# EAGLE design nRF52832_MCU (EAGLE 8.0.1)

## Sheet 1 of 2
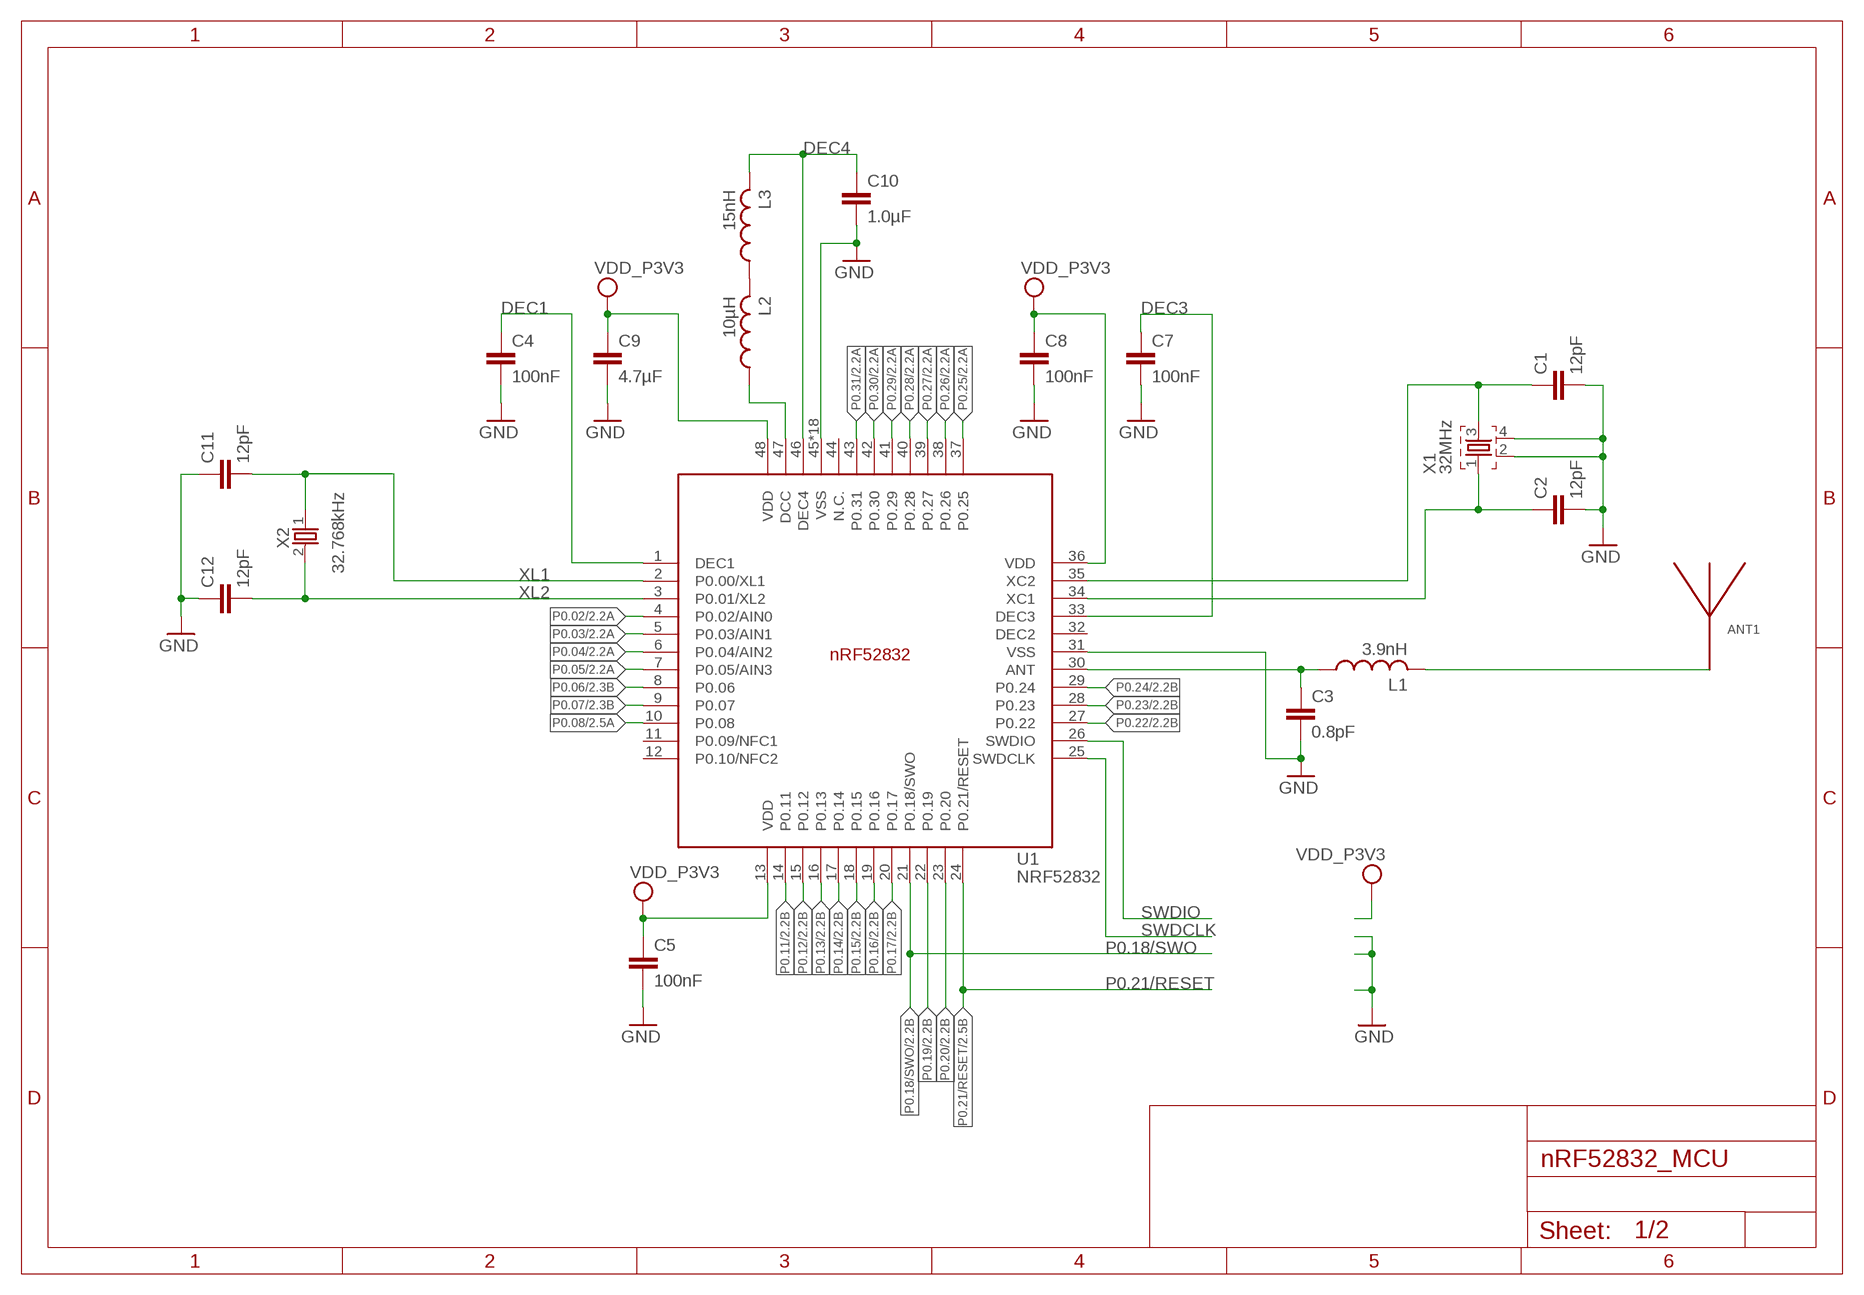
[diagram p0: schematic, sheet 1]

### Parts
ANT1  ANTENNA_QUARTER-WAVE_MONOPOLE_MEANDERED_LEFT  [QWMP_MEANDERED_LEFT_+6]
C1  12pF  CAPACITOR_0402_N  [RESC0402_N]
C2  12pF  CAPACITOR_0402_N  [RESC0402_N]
C3  0.8pF  CAPACITOR_0402_N  [RESC0402_N]
C4  100nF  CAPACITOR_0402_N  [RESC0402_N]
C5  100nF  CAPACITOR_0402_N  [RESC0402_N]
C7  100nF  CAPACITOR_0402_N  [RESC0402_N]
C8  100nF  CAPACITOR_0402_N  [RESC0402_N]
C9  4.7µF  CAPACITOR_0603_N  [RESC0603_N]
C10  1.0µF  CAPACITOR_0603_N  [RESC0603_N]
C11  12pF  CAPACITOR_0402_N  [RESC0402_N]
C12  12pF  CAPACITOR_0402_N  [RESC0402_N]
L1  3.9nH  INDUCTOR_0402_N  [RESC0402_N]
L2  10µH  INDUCTOR_0603_N  [RESC0603_N]
L3  15nH  INDUCTOR_0402_N  [RESC0402_N]
U1  NRF52832  [QFN40P600X600X90-48_N]
X1  32MHz  XTAL_32MHZ  [BT-XTAL_2016_N]
X2  32.768kHz  XTAL_32KHZ  [XTAL_3215_N]

### Nets
ANT: C3.1 L1.1 U1.30(ANT)
DEC1: C4.1 U1.1(DEC1)
DEC3: C7.1 U1.33(DEC3)
DEC4: C10.1 L3.2 U1.46(DEC4)
GND: C1.2 C2.2 C3.2 C4.2 C5.2 C7.2 C8.2 C9.2 C10.2 C11.1 C12.1 U1.31(VSS) U1.45(VSS) U1.PAD(VSS) U1.PAD@VIA01(VSS) U1.PAD@VIA02(VSS) U1.PAD@VIA03(VSS) U1.PAD@VIA04(VSS) U1.PAD@VIA05(VSS) U1.PAD@VIA06(VSS) U1.PAD@VIA07(VSS) U1.PAD@VIA08(VSS) U1.PAD@VIA09(VSS) U1.PAD@VIA10(VSS) U1.PAD@VIA11(VSS) U1.PAD@VIA12(VSS) U1.PAD@VIA13(VSS) U1.PAD@VIA14(VSS) U1.PAD@VIA15(VSS) U1.PAD@VIA16(VSS) X1.2 X1.4 ; also sheet 2
N$2: L2.2 L3.1
N$3: C1.1 U1.35(XC2) X1.3
N$4: L2.1 U1.47(DCC)
N$5: ANT1.P$1 L1.2
P0.02: U1.4(P0.02/AIN0) ; also sheet 2
P0.03: U1.5(P0.03/AIN1) ; also sheet 2
P0.04: U1.6(P0.04/AIN2) ; also sheet 2
P0.05: U1.7(P0.05/AIN3) ; also sheet 2
P0.06: U1.8(P0.06) ; also sheet 2
P0.07: U1.9(P0.07) ; also sheet 2
P0.08: U1.10(P0.08) ; also sheet 2
P0.11: U1.14(P0.11) ; also sheet 2
P0.12: U1.15(P0.12) ; also sheet 2
P0.13: U1.16(P0.13) ; also sheet 2
P0.14: U1.17(P0.14) ; also sheet 2
P0.15: U1.18(P0.15) ; also sheet 2
P0.16: U1.19(P0.16) ; also sheet 2
P0.17: U1.20(P0.17) ; also sheet 2
P0.18/SWO: U1.21(P0.18/SWO) ; also sheet 2
P0.19: U1.22(P0.19) ; also sheet 2
P0.20: U1.23(P0.20) ; also sheet 2
P0.21/RESET: U1.24(P0.21/RESET) ; also sheet 2
P0.22: U1.27(P0.22) ; also sheet 2
P0.23: U1.28(P0.23) ; also sheet 2
P0.24: U1.29(P0.24) ; also sheet 2
P0.25: U1.37(P0.25) ; also sheet 2
P0.26: U1.38(P0.26) ; also sheet 2
P0.27: U1.39(P0.27) ; also sheet 2
P0.28: U1.40(P0.28) ; also sheet 2
P0.29: U1.41(P0.29) ; also sheet 2
P0.30: U1.42(P0.30) ; also sheet 2
P0.31: U1.43(P0.31) ; also sheet 2
SWDCLK: U1.25(SWDCLK)
SWDIO: U1.26(SWDIO)
VDD_P3V3: C5.1 C8.1 C9.1 U1.13(VDD) U1.36(VDD) U1.48(VDD) ; also sheet 2
X1: C2.1 U1.34(XC1) X1.1
XL1: C11.2 U1.2(P0.00/XL1) X2.1
XL2: C12.2 U1.3(P0.01/XL2) X2.2
Unconnected: U1.11(P0.09/NFC1) U1.12(P0.10/NFC2) U1.32(DEC2) U1.44(N.C.)

## Sheet 2 of 2
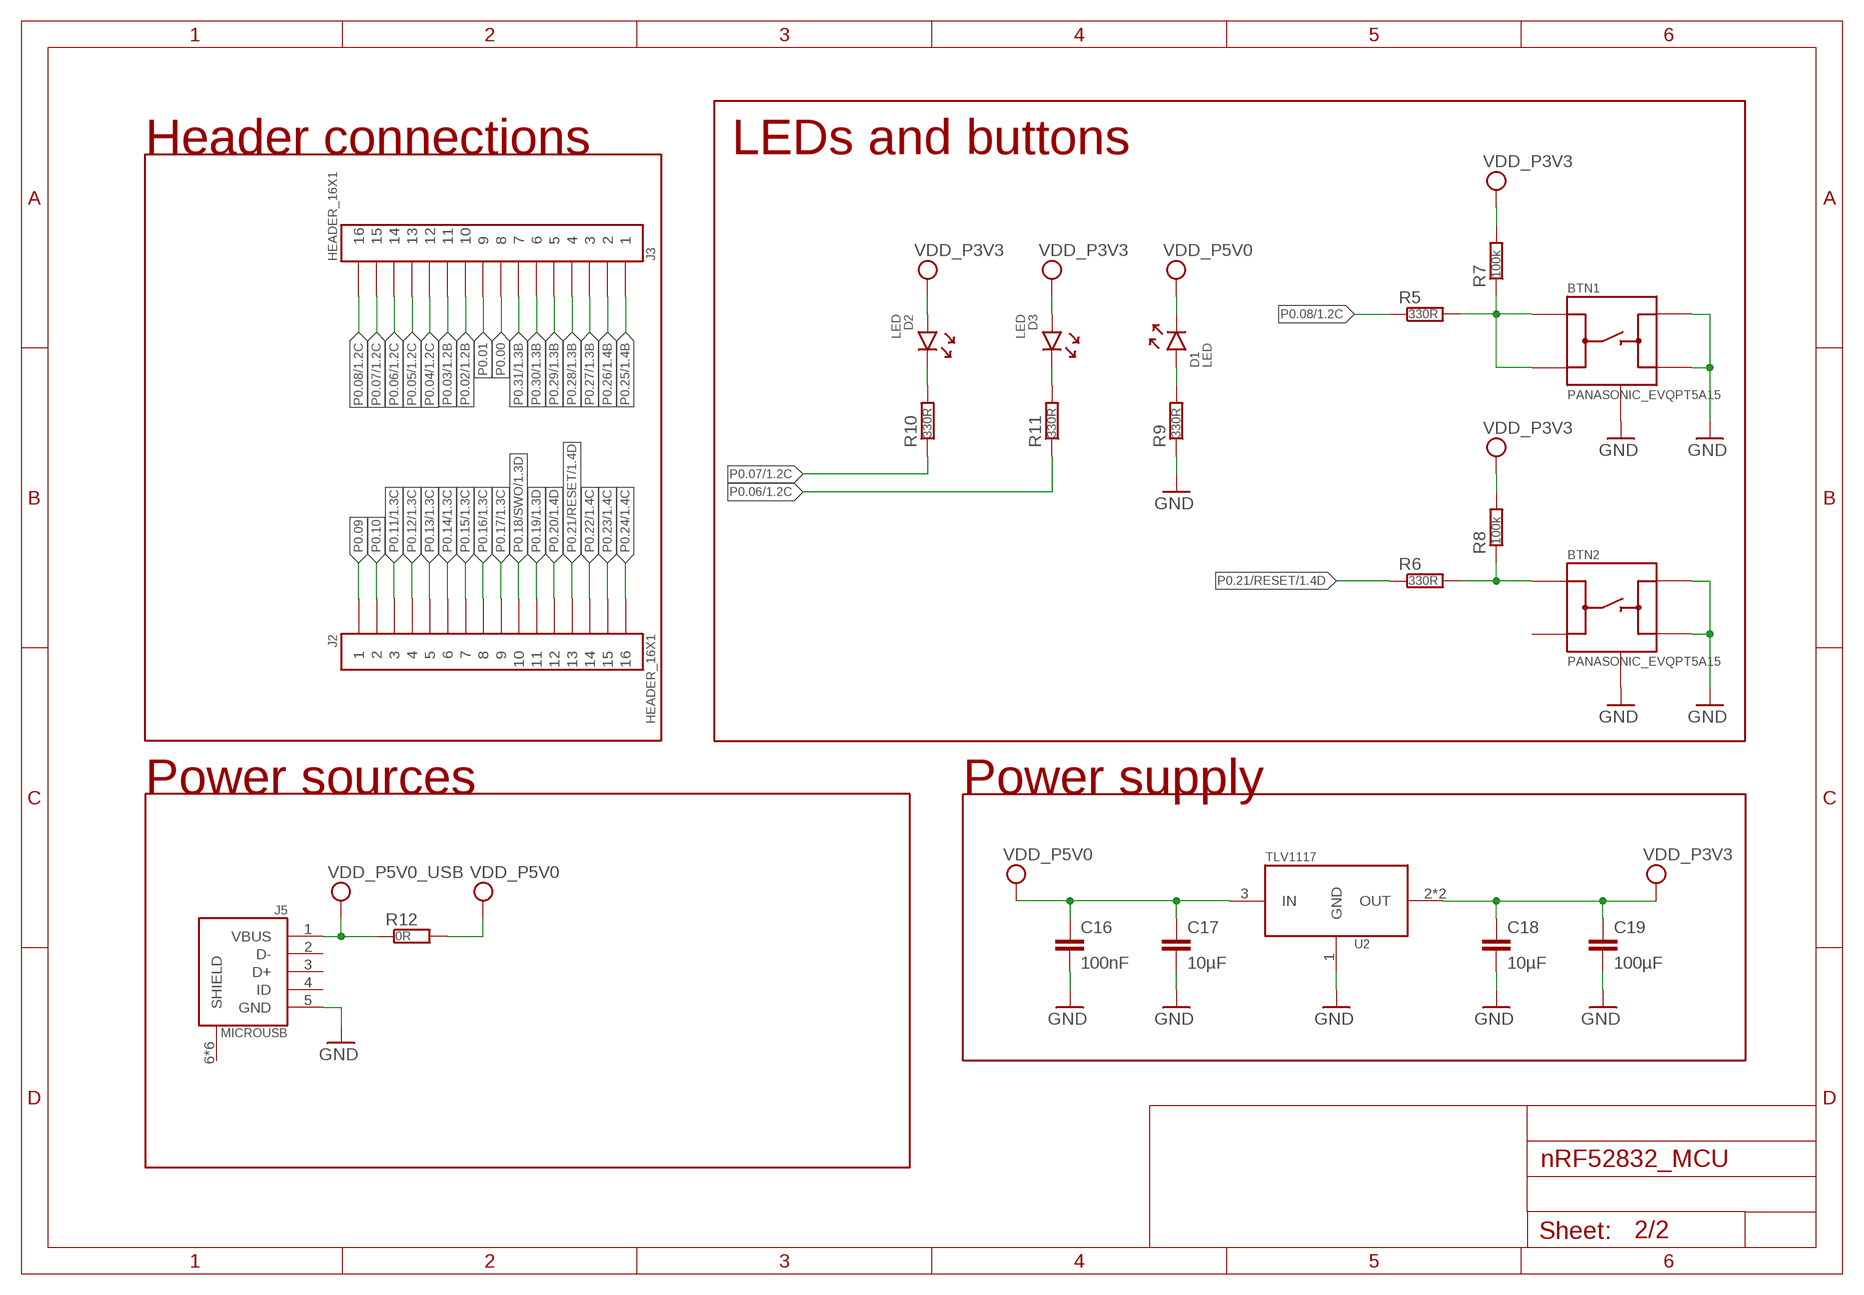
[diagram p1: schematic, sheet 2]

### Parts
BTN1  PANASONIC_EVQPT5A15  [PANASONIC_EVQPT5A15]
BTN2  PANASONIC_EVQPT5A15  [PANASONIC_EVQPT5A15]
C16  100nF  CAPACITOR_0402_N  [RESC0402_N]
C17  10µF  CAPACITOR_0603_N  [RESC0603_N]
C18  10µF  CAPACITOR_0603_N  [RESC0603_N]
C19  100µF  CAPACITOR_0805_N  [RESC0805_N]
D1  LED  [DIOC0603_N]
D2  LED  [DIOC0603_N]
D3  LED  [DIOC0603_N]
J2  HEADER_16X1  [HDRV16W64P254_1X16_4064X254X900B_NO_SILK]
J3  HEADER_16X1  [HDRV16W64P254_1X16_4064X254X900B_NO_SILK]
J5  MICROUSB  [USB-MICRO-B-RA-SMD-PIP]
R5  330R  RESISTOR_0402_N  [RESC0402_N]
R6  330R  RESISTOR_0402_N  [RESC0402_N]
R7  100k  RESISTOR_0402_N  [RESC0402_N]
R8  100k  RESISTOR_0402_N  [RESC0402_N]
R9  330R  RESISTOR_0402_N  [RESC0402_N]
R10  330R  RESISTOR_0402_N  [RESC0402_N]
R11  330R  RESISTOR_0402_N  [RESC0402_N]
R12  0R  RESISTOR_0402_N  [RESC0402_N]
U2  TLV1117  [SOT220P700-4_N]

### Nets
GND: BTN1.3(B) BTN1.4(B') BTN1.5(GND) BTN1.6(GND) BTN2.3(B) BTN2.4(B') BTN2.5(GND) BTN2.6(GND) C16.2 C17.2 C18.2 C19.2 J5.5(GND) R9.1 U2.1(GND) ; also sheet 1
N$6: BTN2.1(A) R6.2 R8.1
N$7: BTN1.1(A) BTN1.2(A') R5.2 R7.1
N$8: D2.1(C) R10.2
N$9: D3.1(C) R11.2
P0.00: J3.P$8
P0.01: J3.P$9
P0.02: J3.P$10 ; also sheet 1
P0.03: J3.P$11 ; also sheet 1
P0.04: J3.P$12 ; also sheet 1
P0.05: J3.P$13 ; also sheet 1
P0.06: J3.P$14 R11.1 ; also sheet 1
P0.07: J3.P$15 R10.1 ; also sheet 1
P0.08: J3.P$16 R5.1 ; also sheet 1
P0.09: J2.P$1
P0.10: J2.P$2
P0.11: J2.P$3 ; also sheet 1
P0.12: J2.P$4 ; also sheet 1
P0.13: J2.P$5 ; also sheet 1
P0.14: J2.P$6 ; also sheet 1
P0.15: J2.P$7 ; also sheet 1
P0.16: J2.P$8 ; also sheet 1
P0.17: J2.P$9 ; also sheet 1
P0.18/SWO: J2.P$10 ; also sheet 1
P0.19: J2.P$11 ; also sheet 1
P0.20: J2.P$12 ; also sheet 1
P0.21/RESET: J2.P$13 R6.1 ; also sheet 1
P0.22: J2.P$14 ; also sheet 1
P0.23: J2.P$15 ; also sheet 1
P0.24: J2.P$16 ; also sheet 1
P0.25: J3.P$1 ; also sheet 1
P0.26: J3.P$2 ; also sheet 1
P0.27: J3.P$3 ; also sheet 1
P0.28: J3.P$4 ; also sheet 1
P0.29: J3.P$5 ; also sheet 1
P0.30: J3.P$6 ; also sheet 1
P0.31: J3.P$7 ; also sheet 1
VCC_P5V0_USB: J5.1(VBUS) R12.1 ; supply symbol labelled VDD_P5V0_USB
VDD_LED: D1.2(A) R9.2
VDD_P3V3: C18.1 C19.1 D2.2(A) D3.2(A) R7.2 R8.2 U2.2(OUT) U2.4(OUT) ; also sheet 1
VDD_P5V0: C16.1 C17.1 D1.1(C) R12.2 U2.3(IN)
Unconnected: BTN2.2(A') J5.2(D-) J5.3(D+) J5.4(ID) J5.6(SHIELD) J5.7(SHIELD) J5.8(SHIELD) J5.9(SHIELD) J5.10(SHIELD) J5.11(SHIELD)

### Notes on the sheet
- Header connections | LEDs and buttons
- Power sources | Power supply

## Library data of the parts
ANT1 = Nordic_misc:ANTENNA_QUARTER-WAVE_MONOPOLE_MEANDERED_LEFT
BTN1 BTN2 = Nordic_misc:PANASONIC_EVQPT5A15
C1-C5 C7-C12 C16-C19 = Nordic_misc:CAPACITOR: Generic chip capacitor
D1-D3 = Nordic_misc:LED
J2 J3 = Nordic_misc:HEADER_16X1
J5 = Nordic_misc:MICROUSB
L1-L3 = Nordic_misc:INDUCTOR: Generic chip inductor
R5-R12 = Nordic_misc:RESISTOR: Generic chip resistor
U1 = Nordic_nRF:NRF52832: nRF52832 Features Single chip, highly flexible, 2.4 GHz multi-protocol SoC 32-bit ARM Cortex-M4F Processor 1.7v to 3.6v operation 512kB flash + 64kB RAM Supports concurrent Bluetooth Smart/ANT protocol operation On-chip NFC tag for Out-of-Band (OOB) pairing Up to +4dBm output power -96dBm sensitivity, Bluetooth Smart Thread safe and run-time protected Event driven API On air compatible with nRF24L and nRF24AP series 2 data rates (2Mbps/1Mbps) PPI - maximum flexibility for power-efficient applications and code simplification Automated power management system with automatic power management of each peripheral Configurable I/O mapping for analog and digital I/O 3 x Master/Slave SPI 2 x Two-wire interface (I²C) UART (RTS/CTS) 3 x PWM AES HW encryption Real Time Counter (RTC) Digital microphone interface (PDM) On-chip balun Applications Internet of Things (IoT) Wearables SmartHome sensors Connected white goods Computer peripherals Voice-command smart remotes A4WP ‘Rezence’ wireless charging Beacons Sports and fitness sensors and hubs Connected health products Smart watches RC Toys Interactive games Building automation and sensor networks
U2 = Nordic_misc:TLV1117
X1 = Nordic_nRF:XTAL_32MHZ
X2 = Nordic_nRF:XTAL_32KHZ

## Board
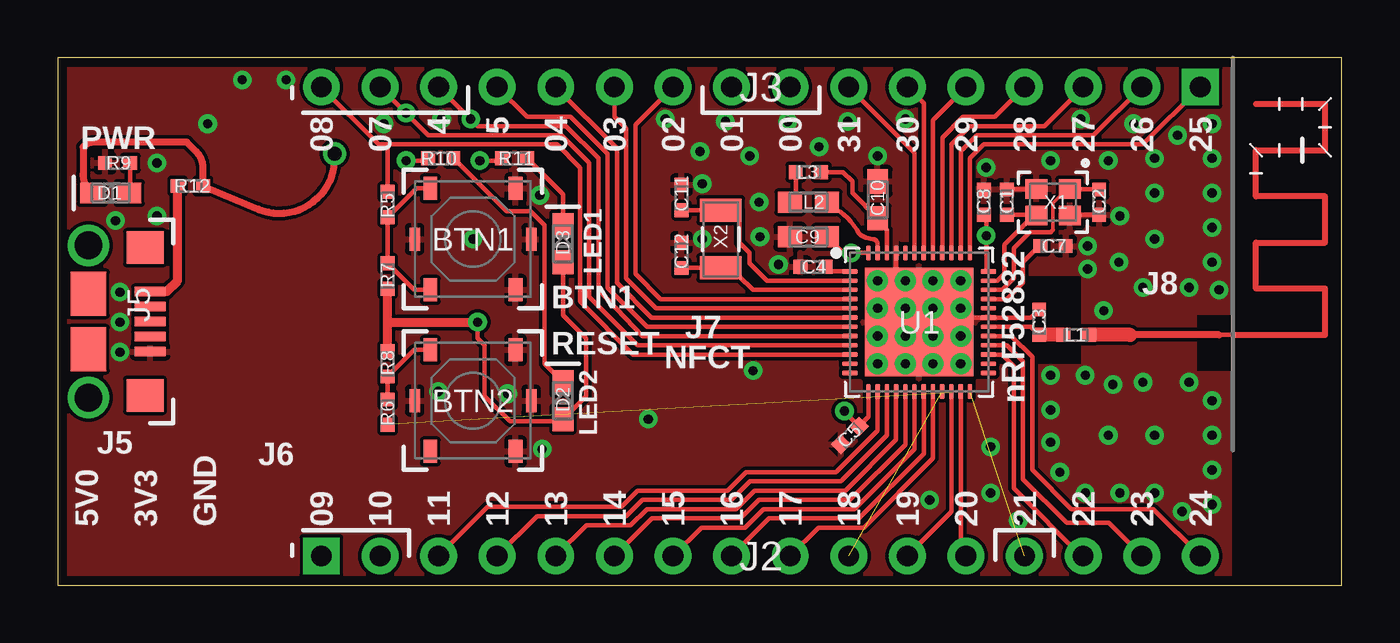
[diagram p2: board, top side]
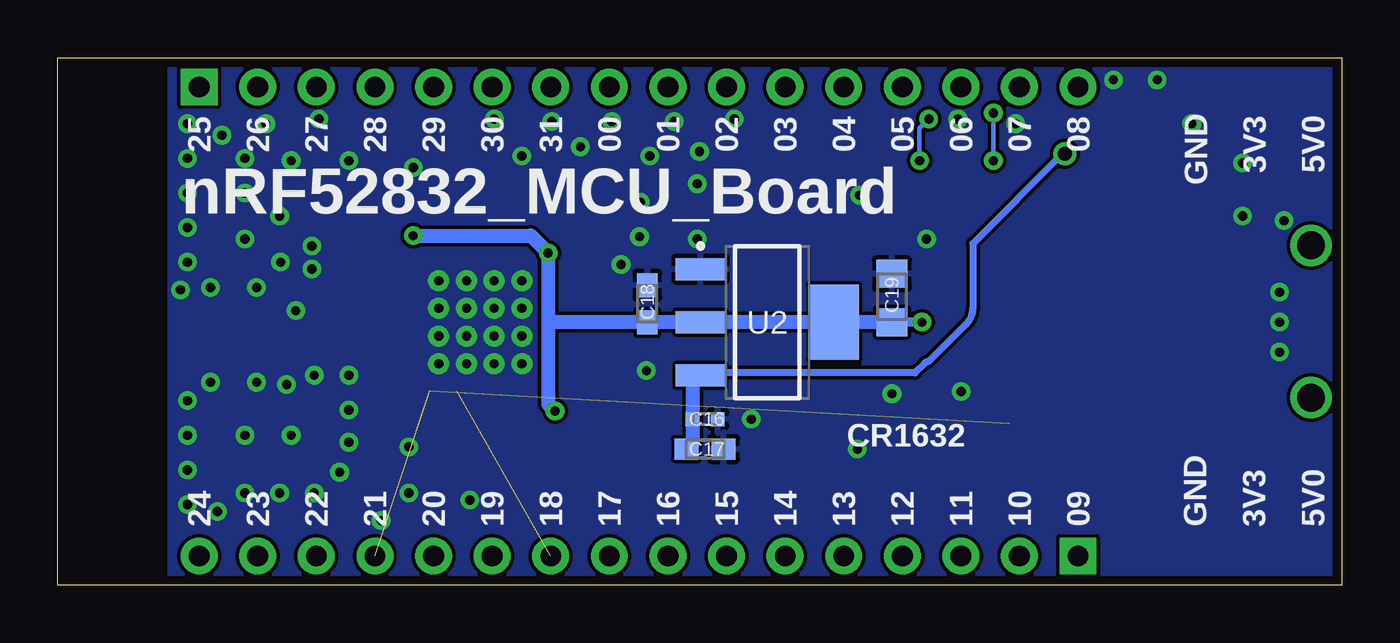
[diagram p3: board, bottom side, seen from below]

Size 55.66 x 22.86 mm. Coordinates in mm from the lower left corner, seen from the top.
Outline: 0,0 55.66,0 55.66,22.86 0,22.86 0,0
Copper layers (1*16): Top 0.035mm / dielectric 1.5mm / Bottom 0.035mm
Design rules "Nordic *": minimum track width 0.15mm, minimum drill 0.4mm, track to track 0.15mm, track to pad 0.15mm, pad to pad 0.15mm, via to via 0.15mm, smd to smd 0.15mm, copper to edge 0.4mm, drill to drill 0.4mm, minimum pad ring 10mil, minimum via ring 8mil, stop-mask expansion 0.1mm, vias tented up to drill 0.41mm, thermal gap 0.2mm
tRestrict: area 50.9,0 to 55.7,22.9; area 40.7,9.6 to 44.3,13.4; area 49.4,9.3 to 50.9,11.7

### Footprints (pad centres in the part's own frame; a part is rotated, then mirrored left to right if it is on the bottom)
QWMP_MEANDERED_LEFT_+6 = smd 0.254 x 0.254: P$1 0,0
PANASONIC_EVQPT5A15 = smd 0.6 x 1: 1 -1.85,2.2; 2 -1.85,-2.2; 3 1.85,2.2; 4 1.85,-2.2 | smd 0.45 x 1: 5 -2.525,0; 6 2.525,0
RESC0402_N = smd 0.6 x 0.6: 1 -0.55,0; 2 0.55,0
RESC0603_N = smd 1.05 x 0.9: 1 -0.8,0; 2 0.8,0
RESC0805_N = smd 1.2 x 1.35: 1 -1.1,0; 2 1,0
DIOC0603_N = smd 1.05 x 0.9: 1 -0.8,0; 2 0.8,0
HDRV16W64P254_1X16_4064X254X900B_NO_SILK = drill 0.9 pad 1.6 square: P$1 -19.05,0 | drill 0.9 pad 1.6: P$2 -16.51,0; P$3 -13.97,0; P$4 -11.43,0; P$5 -8.89,0; P$6 -6.35,0; P$7 -3.81,0; P$8 -1.27,0; P$9 1.27,0; P$10 3.81,0; P$11 6.35,0; P$12 8.89,0; P$13 11.43,0; P$14 13.97,0; P$15 16.51,0; P$16 19.05,0
USB-MICRO-B-RA-SMD-PIP = smd 1.35 x 0.4: 1 0,1.3; 2 0,0.65; 3 0,0; 4 0,-0.65; 5 0,-1.3 | smd 1.6 x 1.4: 6 -0.225,3.2; 7 -0.225,-3.2 | smd 1.55 x 1.9: 8 -2.675,1.2; 9 -2.675,-1.2 | drill 1.2: 10 -2.675,3.3; 11 -2.675,-3.3
QFN40P600X600X90-48_N = smd 0.65 x 0.2: 1 -3,2.2; 2 -3,1.8; 3 -3,1.4; 4 -3,1; 5 -3,0.6; 6 -3,0.2; 7 -3,-0.2; 8 -3,-0.6; 9 -3,-1; 10 -3,-1.4; 11 -3,-1.8; 12 -3,-2.2; 25 3,-2.2; 26 3,-1.8; 27 3,-1.4; 28 3,-1; 29 3,-0.6; 30 3,-0.2; 31 3,0.2; 32 3,0.6; 33 3,1; 34 3,1.4; 35 3,1.8; 36 3,2.2 | smd 0.2 x 0.65: 13 -2.2,-3; 14 -1.8,-3; 15 -1.4,-3; 16 -1,-3; 17 -0.6,-3; 18 -0.2,-3; 19 0.2,-3; 20 0.6,-3; 21 1,-3; 22 1.4,-3; 23 1.8,-3; 24 2.2,-3; 37 2.2,3; 38 1.8,3; 39 1.4,3; 40 1,3; 41 0.6,3; 42 0.2,3; 43 -0.2,3; 44 -0.6,3; 45 -1,3; 46 -1.4,3; 47 -1.8,3; 48 -2.2,3 | smd 4.7 x 4.7: PAD 0,0 | drill 0.4: PAD@VIA01 -1.8,1.8; PAD@VIA02 -1.8,0.6; PAD@VIA03 -1.8,-0.6; PAD@VIA04 -1.8,-1.8; PAD@VIA05 -0.6,1.8; PAD@VIA06 -0.6,0.6; PAD@VIA07 -0.6,-0.6; PAD@VIA08 -0.6,-1.8; PAD@VIA09 0.6,1.8; PAD@VIA10 0.6,0.6; PAD@VIA11 0.6,-0.6; PAD@VIA12 0.6,-1.8; PAD@VIA13 1.8,1.8; PAD@VIA14 1.8,0.6; PAD@VIA15 1.8,-0.6; PAD@VIA16 1.8,-1.8
SOT220P700-4_N = smd 2.15 x 0.95: 1 -2.9,2.3; 2 -2.9,0; 3 -2.9,-2.3 | smd 2.15 x 3.25: 4 2.9,0
BT-XTAL_2016_N = smd 0.95 x 0.85: 1 -0.725,-0.575; 2 0.725,-0.575; 3 0.725,0.575; 4 -0.725,0.575
XTAL_3215_N = smd 1 x 1.8: 1 -1.25,0; 2 1.25,0

### Placement (x,y rotation side)
ANT1  50.94,10.85 0 top
BTN1  18,15 0 top
BTN2  18,8 0 top
C1  41.14,16.6 90 top
C2  45.14,16.6 270 top
C3  42.54,11.4 90 top
C4  32.74,13.8 180 top
C5  34.34,6.5 225 top
C7  43.14,14.7 0 top
C8  40.14,16.6 90 top
C9  32.54,15.1 180 top
C10  35.54,16.7 90 top
C11  27.04,16.8 270 top
C12  27.04,14.3 270 top
C16  27.6,7.2 0 bottom
C17  27.6,5.9 0 bottom
C18  30.1,12.2 90 bottom
C19  19.5,12.5 90 bottom
D1  2.3,17 0 top
D2  21.9,8 270 top
D3  21.9,14.8 270 top
J2  30.48,1.27 0 top
J3  30.48,21.59 180 top
J5  4.01,11.43 0 top
L1  44.14,10.85 0 top
L2  32.54,16.6 180 top
L3  32.54,17.9 0 top
R5  14.3,16.5 270 top
R6  14.3,7.5 90 top
R7  14.3,13.4 270 top
R8  14.3,9.6 90 top
R9  2.6,18.3 0 top
R10  16.6,18.5 0 top
R11  19.8,18.5 0 top
R12  5.75,17.3 0 top
U1  37.34,11.4 0 top
U2  24.9,11.4 0 bottom
X1  43.14,16.6 180 top
X2  28.74,15 270 top

### Tracks (layer width: path | path; a pad name or v marks a point on that pad's centre or on a via)
ANT
  Top 0.2: U1.30 42.19,11.2 C3.1 42.59,10.85
  Top 0.6: L1.1 42.59,10.85
DEC1
  Top 0.2: U1.1 33.49,13.6 C4.1
DEC3
  Top 0.2: U1.33 41.14,12.4 41.84,13.1 41.84,14 42.49,14.65 C7.1
DEC4
  Top 0.2: U1.46 35.94,15.4 C10.1 34.44,17 34.44,17.5 34.04,17.9 L3.2
GND  (via drill 0.4, 0.4 pad 0.8)
  Top 0.2: 39.19,11.59 U1.31 42.19,11.6 C3.2 | 39.19,11.59 arc-90 U1.PAD@VIA14 | 36.39,13.39 arc90 U1.PAD@VIA05 | U1.PAD@VIA01 36.34,13.2 | 36.34,13.2 U1.PAD@VIA05 | U1.PAD@VIA05 U1.PAD@VIA09 U1.PAD@VIA13 U1.PAD@VIA14 | U1.PAD@VIA02 U1.PAD@VIA06 | U1.PAD@VIA06 U1.PAD@VIA10 U1.PAD@VIA14 | 39.19,11.59 39.19,11.19 arc-90 U1.PAD@VIA15 | U1.PAD@VIA15 U1.PAD@VIA16 U1.PAD@VIA12 | U1.PAD@VIA15 U1.PAD@VIA11 U1.PAD@VIA07 U1.PAD@VIA03 U1.PAD@VIA04 U1.PAD@VIA08 | U1.PAD@VIA06 arc90 U1.PAD | U1.45 36.34,13.2 | C2.2 43.89,16.05 X1.4 | C1.2 42.39,17.15 X1.2 | 32.19,14.85 C9.2
  other vias: 27.94,15 27.94,17.4 35.54,18.6 30.44,15.1 40.24,18.1 44.64,14.7 44.64,13.7 45.74,8.7 47.04,8.8 49.04,8.8 49.04,12.9 47.04,12.9 50.34,12.8 43.04,9.1 43.04,7.6 43.04,6.2 43.44,4.9 44.54,4 46.04,4 47.54,4 48.74,3.2 50.04,3.5 50.04,5 50.04,6.5 50.04,8 45.54,6.5 47.54,6.5 44.54,9.1 45.34,11.9 50.04,14 50.04,15.5 50.04,17 50.04,18.5 50.04,20 48.54,19.5 47.54,18.5 45.54,18.4 43.04,18.4 47.54,17 47.54,15 30.14,9.3 46.04,16 40.44,6 40.44,4 41.64,2.8 14.14,20 16.64,20.2 26.34,20.2 27.84,18.8 28.94,20.1 31.64,20.1 34.24,20.1 36.74,20.2 46.64,20 44.34,20.2 31.24,13.9 37.8,3.7 25.6,7.2 18,15 4.3,18.3 20.9,16.9 16.5,8.4 19.5,8.3 21,5.9 30,18.6 2.5,15.8 2.7,12.7 2.7,11.4 2.7,10.1 4.3,16 6.5,20 8,21.9 9.9,21.9 33,19 30.4,16.6 46,14
  pour Bottom: 0,0 0,22.86 50.8,22.86 50.8,0
  pour Top: 0,0 0,22.86 50.8,22.86 50.8,0
N$2
  Top 0.2: L2.2 31.99,16.6 L3.1
N$3
  Top 0.2: C1.1 42.34,16.05 | 42.34,16.05 42.39,16.05 X1.3 | 42.34,16.05 41.04,14.75 41.04,13.5 40.74,13.2 U1.35
N$4
  Top 0.2: L2.1 33.74,16.3 arc-29 34.64,15.4 arc45 34.94,15.1 arc17 35.34,15 arc-79 35.54,14.8 U1.47
N$5
  Top 0.2: ANT1.P$1 50.34,10.85
  Top 0.305: 50.34,10.85 46.49,10.85
  Top 0.6: 46.49,10.85 L1.2
N$6
  Top 0.2: BTN2.1 15.45,10.2 R8.1 R6.2
N$7
  Top 0.2: BTN1.2 15.45,12.8 R7.1 R5.2 15.55,17.2 BTN1.1
N$8
  Top 0.2: R10.2 19.45,16.2 20.5,16.2 21.1,15.6 21.1,9.6 D2.1
N$9
  Top 0.2: R11.2 21.9,16.95 D3.1
P0.02
  Top 0.2: U1.4 26.14,12.4 25.04,13.5 25.04,19.96 J3.P$10
P0.03
  Top 0.2: U1.5 25.94,12 24.64,13.3 24.64,19.8 24.13,20.31 J3.P$11
P0.04
  Top 0.2: U1.6 25.74,11.6 24.24,13.1 24.24,18.94 J3.P$12
P0.05
  Top 0.2: U1.7 25.54,11.2 23.84,12.9 23.84,18.7 22.24,20.3 20.34,20.3 J3.P$13
P0.06  (via drill 0.4, 0.4 pad 0.8)
  Top 0.2: U1.8 25.34,10.8 23.44,12.8 23.44,18.5 22.04,19.9 18.2,19.9 v17.9,20.2 J3.P$14 | v18.3,18.4 19.15,18.4 arc90 R11.1
  Bottom 0.2: v18.3,18.4 18.3,19.8 v17.9,20.2
P0.07  (via drill 0.4, 0.4 pad 0.8)
  Top 0.2: U1.9 25.14,10.4 23.04,12.5 23.04,18.3 21.84,19.5 16.06,19.5 v15.1,20.46 J3.P$15 | v15.1,18.4 15.95,18.4 arc90 R10.1
  Bottom 0.2: v15.1,20.46 v15.1,18.4
P0.08
  Top 0.2: U1.10 24.94,10 22.64,12.3 22.64,18.1 21.64,19.1 14.3,19.1 | 14.3,19.1 13.92,19.1 J3.P$16 | R5.1 14.3,19.1
P0.11
  Top 0.2: U1.14 35.54,6.7 33.74,4.9 29.84,4.9 29.04,4.1 25.14,4.1 24.44,3.4 18.64,3.4 J2.P$3
P0.12
  Top 0.2: U1.15 35.94,6.5 33.94,4.5 30,4.5 29.2,3.7 25.34,3.7 24.64,3 20.78,3 J2.P$4
P0.13
  Top 0.2: U1.16 36.34,6.3 34.14,4.1 30.2,4.1 29.4,3.3 25.54,3.3 24.84,2.6 22.92,2.6 J2.P$5
P0.14
  Top 0.2: U1.17 36.74,6.1 34.34,3.7 30.4,3.7 29.6,2.9 25.76,2.9 J2.P$6
P0.15
  Top 0.2: U1.18 37.14,5.9 34.54,3.3 30.6,3.3 29.8,2.5 27.9,2.5 J2.P$7
P0.16
  Top 0.2: U1.19 37.54,5.7 34.74,2.9 30.84,2.9 J2.P$8
P0.17
  Top 0.2: U1.20 37.94,5.5 34.94,2.5 32.98,2.5 J2.P$9
P0.18/SWO  (1 unrouted)
P0.19
  Top 0.2: U1.22 38.74,3.18 J2.P$11
P0.20
  Top 0.2: U1.23 39.14,1.5 J2.P$12
P0.21/RESET  (2 unrouted)
  Top 0.2: 14.4,7 14.3,7 R6.1
P0.22
  Top 0.2: U1.27 40.94,10 41.44,9.5 41.44,4.2 44.44,1.2 J2.P$14
P0.23
  Top 0.2: U1.28 41.14,10.4 41.84,9.7 41.84,4.6 43.74,2.7 45.56,2.7 J2.P$15
P0.24
  Top 0.2: U1.29 41.34,10.8 42.24,9.9 42.24,5 43.94,3.3 47.5,3.3 J2.P$16
P0.25
  Top 0.2: U1.37 39.54,18.5 40.14,19.1 47.04,19.1 J3.P$1
P0.26
  Top 0.2: U1.38 39.14,18.8 39.84,19.5 44.9,19.5 J3.P$2
P0.27
  Top 0.2: U1.39 38.74,19.1 39.54,19.9 42.76,19.9 J3.P$3
P0.28
  Top 0.2: U1.40 38.34,19.4 39.24,20.3 40.62,20.3 J3.P$4
P0.29
  Top 0.2: U1.41 37.94,20.16 J3.P$5
P0.30
  Top 0.2: U1.42 37.54,20.88 J3.P$6
P0.31
  Top 0.2: U1.43 37.14,18.74 J3.P$7
VCC_P5V0_USB
  Top 0.4: J5.1 4.73,12.73 5.2,13.2 R12.1
VDD_LED
  Top 0.2: R9.2 3.15,17.25 D1.2
VDD_P3V3  (via drill 0.4, 0.4 pad 0.8)
  Top 0.2: U1.13 35.14,7.3 C5.1 34.1,7.52 v34.1,7.55 | U1.48 v34.4,14.4 34.04,14.4 C9.1 | U1.36 40.25,13.69 v40.25,15.15 40.25,15.94 C8.1 | D3.2 21.9,11.7 22.9,10.7 22.9,8.2 D2.2 21.8,7.1 19.6,7.1 18.5,8.2 18.5,10.4 18.2,10.7 v18.2,11.4 | R8.2 14.3,11.4
  Top 0.4: R8.2 R7.2 | 14.3,11.4 v18.2,11.4
  Bottom 0.4: v18.2,11.4 C19.1
  Bottom 0.6: v40.25,15.15 35.15,15.15 v34.4,14.4 | v34.4,14.4 34.4,11.3 | 34.4,11.3 34.4,7.85 v34.1,7.55 | v34.4,14.4 34.4,11.4 | C18.1 U2.2 U2.4 C19.1 | 30.1,11.3 C18.1 | C18.1 34.3,11.4 34.4,11.3
VDD_P5V0  (via drill 0.6)
  Top 0.305: v12,18.7 arc5 12,18.6 arc-115 8.7,16.3 R12.2 6.3,18.09 arc45 6.01,18.79 5.6,19.2 1.58,19.2 arc45 1.1,19 1.1,17.81 arc45 1.39,17.11 D1.1
  Bottom 0.305: v12,18.7 arc-45 12.17,18.63 16,14.8 16,12.01 arc45 16.29,11.31 17.9,9.7 arc-45 18.07,9.63 18.5,9.2 27.56,9.2 arc-45 U2.3
  Bottom 0.6: U2.3 arc-90 28.15,8.75 C16.1 28.15,6.15 arc90 C17.1
X1
  Top 0.15: 43.14,15.4 43.14,16.55 43.77,17.18 X1.1
  Top 0.2: C2.1 43.89,17.15 X1.1 | 43.14,15.4 43.04,15.3 42.14,15.3 41.44,14.6 41.44,13.3 40.94,12.8 U1.34
XL1
  Top 0.2: 28.84,16.25 29.55,16.25 29.55,14.85 29.99,14.41 29.99,13.95 30.74,13.2 U1.2 | 28.84,16.25 X2.1 C11.2 | 29.24,16.2 29.14,16.1 28.84,16.1 28.84,16.25
XL2
  Top 0.2: 28.94,13.7 28.79,13.7 X2.2 C12.2 | 28.94,13.7 29.24,13.7 | U1.3 30.14,12.8 29.54,13.4 29.24,13.4 28.94,13.7

### Text on the board
tPlace: 08 | 07 | 4 | 5 | 04 | 03 | 02 | 01 | 00 | 31 | 30 | 29 | 28 | 27 | 26 | 25 | PWR | LED1 | J8 | BTN1 | J7 | RESET | NFCT | nRF52832 | J5 | J6 | LED2 | 5V0 | 3V3 | GND | 09 | 10 | 11 | 12 | 13 | 14 | 15 | 16 | 17 | 18 | 19 | 20 | 21 | 22 | 23 | 24
bPlace: 5V0 | 3V3 | GND | 08 | 07 | 06 | 05 | 04 | 03 | 02 | 01 | 00 | 31 | 30 | 29 | 28 | 27 | 26 | 25 | nRF52832_MCU_Board | CR1632 | 5V0 | 3V3 | GND | 09 | 10 | 11 | 12 | 13 | 14 | 15 | 16 | 17 | 18 | 19 | 20 | 21 | 22 | 23 | 24